# Altium project elektronicy-p-lodz-pl-2018.PrjPCB
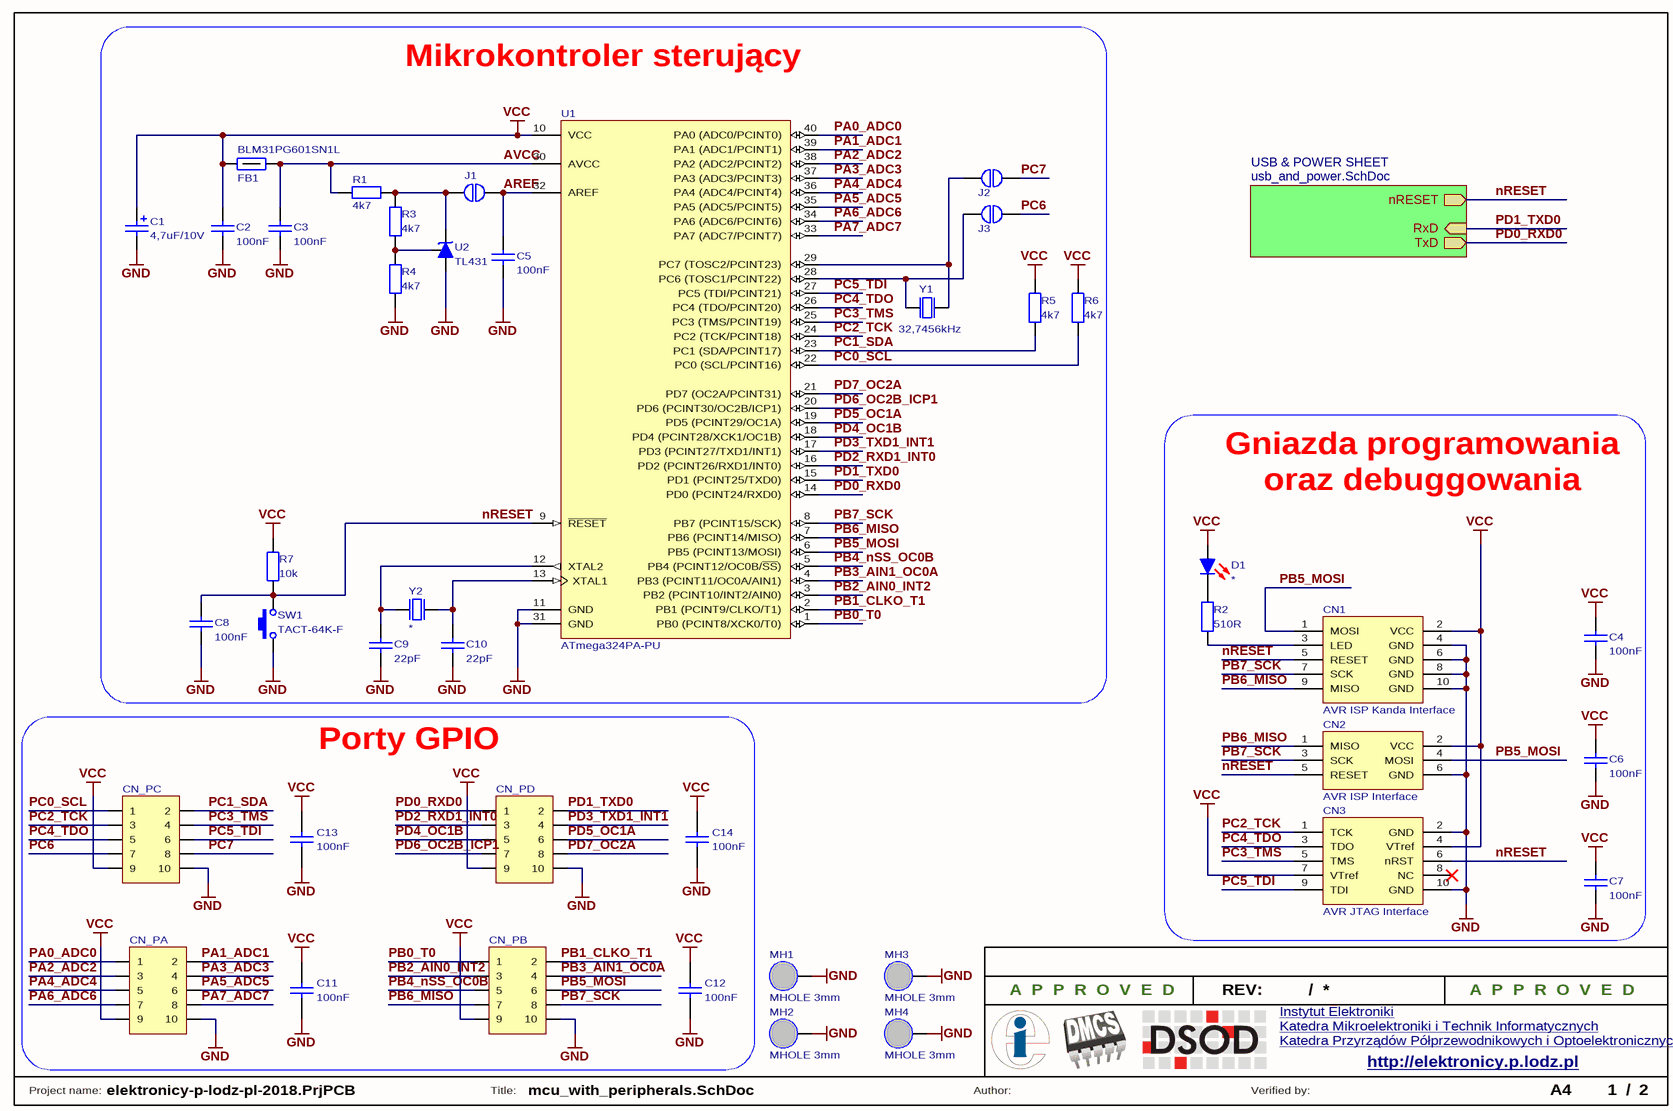
[diagram p0: mcu_with_peripherals.SchDoc]
2 sheets, 72 parts. Net scope: hierarchical (ports join the sheet entries above them; power ports are global).
Board file: pcb.PcbDoc
Sheets:
  mcu_with_peripherals.SchDoc
    USB & POWER SHEET = usb_and_power.SchDoc

## Sheet mcu_with_peripherals.SchDoc
size A4; SheetNumber: 1; SheetTotal: 2; Size: A4; Contact: datasystem.pl

### Parts
C1  4,7uF/10V  [SMDB]
C2  100nF  [C1206]
C3  100nF  [C1206]
C4  100nF  [C1206]
C5  100nF  [C1206]
C6  100nF  [C1206]
C7  100nF  [C1206]
C8  100nF  [C1206]
C9  22pF  [C1206]
C10  22pF  [C1206]
C11  100nF  [C1206]
C12  100nF  [C1206]
C13  100nF  [C1206]
C14  100nF  [C1206]
CN1  AVR ISP Kanda Interface  [IDC10]
CN2  AVR ISP Interface  [IDC6]
CN3  AVR JTAG Interface  [IDC10]
CN_PA  IDC Connector  [IDC10]  (value not drawn)
CN_PB  IDC Connector  [IDC10]  (value not drawn)
CN_PC  IDC Connector  [IDC10]  (value not drawn)
CN_PD  IDC Connector  [IDC10]  (value not drawn)
D1  *  [LED1206R]
FB1  BLM31PG601SN1L  [FB1206]
J1  *  [JMP2_0603_NO]  (value not drawn)
J2  *  [JMP2_0603_NO]  (value not drawn)
J3  *  [JMP2_0603_NO]  (value not drawn)
MH1  MHOLE 3mm  [3mm screw drill III]  (no BOM)
MH2  MHOLE 3mm  [3mm screw drill III]  (no BOM)
MH3  MHOLE 3mm  [3mm screw drill III]  (no BOM)
MH4  MHOLE 3mm  [3mm screw drill III]  (no BOM)
R1  4k7  [R1206]
R2  510R  [R1206]
R3  4k7  [R1206]
R4  4k7  [R1206]
R5  4k7  [R1206]
R6  4k7  [R1206]
R7  10k  [R1206]
SW1  TACT-64K-F  [TACT-64K-F]
U1  ATmega324PA-PU  [DIP40_PRECISION_W_IC]
U2  TL431  [SOT-23]
Y1  32,7456kHz  [TC38_3x8_H]
Y2  *  [HC49-S]

### Blocks framed on the sheet
Mikrokontroler sterujący: C1-C3 C5 C8-C10 FB1 J1-J3 R1 R3-R7 SW1 U1 U2 Y1 Y2
Porty GPIO: C11-C14 CN_PA CN_PB CN_PC CN_PD

### Sub-sheets
USB & POWER SHEET = usb_and_power.SchDoc: RxD (in), TxD (out), nRESET (out)

### Nets
GND: C1.2 C2.1 C3.1 C4.1 C5.1 C6.1 C7.1 C8.1 C9.1 C10.1 C11.1 C12.1 C13.1 C14.1 CN1.4(GND) CN1.6(GND) CN1.8(GND) CN1.10(GND) CN2.6(GND) CN3.2(GND) CN3.10(GND) CN_PA.10 CN_PB.10 CN_PC.10 CN_PD.10 MH1.1(GND) MH2.1(GND) MH3.1(GND) MH4.1(GND) R4.2 SW1.1 U1.11(GND) U1.31(GND) U2.3(A)
VCC: C1.1 C2.2 C4.2 C6.2 C7.2 C11.2 C12.2 C13.2 C14.2 CN1.2(VCC) CN2.2(VCC) CN3.4(VTref) CN3.7(VTref) CN_PA.9 CN_PB.9 CN_PC.9 CN_PD.9 D1.1(A) FB1.1 R5.2 R6.2 R7.2 U1.10(VCC)
AREF: C5.2 J1.2 U1.32(AREF)
AVCC: C3.2 FB1.2 R1.1 U1.30(AVCC)
nRESET: C8.2 CN1.5(RESET) CN2.5(RESET) CN3.6(nRST) R7.1 SW1.2 U1.9(~{RESET}) ; sheet USB & POWER SHEET/nRESET
PA0_ADC0: CN_PA.1 U1.40(PA0_(ADC0/PCINT0))
PA1_ADC1: CN_PA.2 U1.39(PA1_(ADC1/PCINT1))
PA2_ADC2: CN_PA.3 U1.38(PA2_(ADC2/PCINT2))
PA3_ADC3: CN_PA.4 U1.37(PA3_(ADC3/PCINT3))
PA4_ADC4: CN_PA.5 U1.36(PA4_(ADC4/PCINT4))
PA5_ADC5: CN_PA.6 U1.35(PA5_(ADC5/PCINT5))
PA6_ADC6: CN_PA.7 U1.34(PA6_(ADC6/PCINT6))
PA7_ADC7: CN_PA.8 U1.33(PA7_(ADC7/PCINT7))
PB0_T0: CN_PB.1 U1.1(PB0_(PCINT8/XCK0/T0))
PB1_CLKO_T1: CN_PB.2 U1.2(PB1_(PCINT9/CLKO/T1))
PB2_AIN0_INT2: CN_PB.3 U1.3(PB2_(PCINT10/INT2/AIN0))
PB3_AIN1_OC0A: CN_PB.4 U1.4(PB3_(PCINT11/OC0A/AIN1))
PB4_nSS_OC0B: CN_PB.5 U1.5(PB4_(PCINT12/OC0B/~{SS}))
PB5_MOSI: CN1.1(MOSI) CN2.4(MOSI) CN_PB.6 U1.6(PB5_(PCINT13/MOSI))
PB6_MISO: CN1.9(MISO) CN2.1(MISO) CN_PB.7 U1.7(PB6_(PCINT14/MISO))
PB7_SCK: CN1.7(SCK) CN2.3(SCK) CN_PB.8 U1.8(PB7_(PCINT15/SCK))
PC0_SCL: CN_PC.1 R6.1 U1.22(PC0_(SCL/PCINT16))
PC1_SDA: CN_PC.2 R5.1 U1.23(PC1_(SDA/PCINT17))
PC2_TCK: CN3.1(TCK) CN_PC.3 U1.24(PC2_(TCK/PCINT18))
PC3_TMS: CN3.5(TMS) CN_PC.4 U1.25(PC3_(TMS/PCINT19))
PC4_TDO: CN3.3(TDO) CN_PC.5 U1.26(PC4_(TDO/PCINT20))
PC5_TDI: CN3.9(TDI) CN_PC.6 U1.27(PC5_(TDI/PCINT21))
PC6: CN_PC.7 J3.2
PC7: CN_PC.8 J2.2
PD0_RXD0: CN_PD.1 U1.14(PD0_(PCINT24/RXD0)) ; sheet USB & POWER SHEET/TxD
PD1_TXD0: CN_PD.2 U1.15(PD1_(PCINT25/TXD0)) ; sheet USB & POWER SHEET/RxD
PD2_RXD1_INT0: CN_PD.3 U1.16(PD2_(PCINT26/RXD1/INT0))
PD3_TXD1_INT1: CN_PD.4 U1.17(PD3_(PCINT27/TXD1/INT1))
PD4_OC1B: CN_PD.5 U1.18(PD4_(PCINT28/XCK1/OC1B))
PD5_OC1A: CN_PD.6 U1.19(PD5_(PCINT29/OC1A))
PD6_OC2B_ICP1: CN_PD.7 U1.20(PD6_(PCINT30/OC2B/ICP1))
PD7_OC2A: CN_PD.8 U1.21(PD7_(OC2A/PCINT31))
NetC9_2: C9.2 U1.12(XTAL2) Y2.1(OSC1)
NetC10_2: C10.2 U1.13(XTAL1) Y2.2(OSC2)
NetCN1_3: CN1.3(LED) R2.1
NetD1_2: D1.2(K) R2.2
NetJ1_1: J1.1 R1.2 R3.1 U2.1(K)
NetJ2_1: J2.1 U1.29(PC7_(TOSC2/PCINT23)) Y1.1(OSC1)
NetJ3_1: J3.1 U1.28(PC6_(TOSC1/PCINT22)) Y1.2(OSC2)
NetR3_2: R3.2 R4.1 U2.2(REF)

Not connected (* = marked no-connect by the designer): CN3 8(NC)*

### Notes on the sheet
- Gniazda programowania
- oraz debuggowania
- A  P  P  R  O  V  E  D
- REV:
- /
- Instytut Elektroniki <http://www.eletel.p.lodz.pl/>
- Katedra Mikroelektroniki i Technik Informatycznych <https://www.dmcs.pl/>
- Katedra Przyrządów Półprzewodnikowych i Optoelektronicznych <http://www.dsod.p.lodz.pl/>
- http://elektronicy.p.lodz.pl
- Project name:
- Title:
- Author:
- Verified by:

### Library data of the parts
C1 = Cap Pol Tant: Polarized Tantalum Capacitor; ComponentLink1Description: datasheet; ComponentLink2Description: supplier; Value: 4,7uF/10V
C2-C14 = Cap: Capacitor; ComponentLink1Description: datasheet; ComponentLink2Description: supplier
  C2-C8 C11-C14: Value: 100nF
  C9 C10: Value: 22pF
CN1 = AVR ISP Kanda Interface: Kanda ISP Programming Header for AVR MCU's
CN2 = AVR ISP Interface: ISP Programming Header for AVR MCU's
CN3 = AVR JTAG Interface: JTAG Header for AVR MCU's
CN_PA CN_PB CN_PC CN_PD = CN_5x2
D1 = LED_RED: RED LED; Published: 04-Apr-2006
FB1 = BLM31PG601SN1L: Ferrite Bead; Imp.@ 100MHz:600R; Mounting: SMD; 1,5A; Case: 1206
J1-J3 = JUMPER2_NO: Solder Jumper - Open
MH1-MH4 = MHOLE_3MM: 3mm Mounting Hole
R1 R3-R7 = Res: Resistor; Published: 19-Feb-2006; ComponentLink1Description: datasheet; ComponentLink2Description: supplier
  R1 R3-R6: Value: 4k7
  R7: Value: 10k
R2 = Res: Resistor; Value: 4k7; Published: 19-Feb-2006; ComponentLink1Description: datasheet; ComponentLink2Description: supplier
SW1 = TACT-64K-F: 6x6mm THT Tactile SPST-NO Switch; Published: 30-Jun-2006
U1 = ATmega324PA-PU: 8-bit AVR Microcontroller, 32KB Flash, 1KB EEPROM, 2KB SRAM, 40-pin PDIP, Industrial Grade (-40°C to 85°C); DatasheetVersion: revC, Jun-2011; PackageVersion: revB, Sep-2001; PackageReference: 40P6; PackageDescription: 40-lead (0.600"/15.24mm Wide) Plastic Dual Inline Package (PDIP); Code_JEDEC: MS-011-AC; ComponentLink1Description: Manufacturer URL; ComponentLink1URL: http://www.atmel.com/; ComponentLink2Description: ATmega164A/164PA/324A/324PA/644A/644PA/1284/1284P Datasheet; ComponentLink2URL: http://www.atmel.com/dyn/resources/prod_documents/doc8272.pdf; ComponentLink3Description: ATmega164A/164PA/324A/324PA/644A/644PA/1284/1284P Summary; ComponentLink3URL: http://www.atmel.com/dyn/resources/prod_documents/8272S.pdf
U2 = TL431BCDBZ: 0,5% Precision Programmable Reference
Y1 = Clock XTAL: Crystal Clock Oscillator; ComponentLink1Description: datasheet; ComponentLink2Description: supplier; Value: 32,7456kHz
Y2 = XTAL_2PIN: Crystal Oscillator; ComponentLink1Description: datasheet; ComponentLink2Description: supplier; Value: *

## Sheet usb_and_power.SchDoc
size A4; SheetNumber: 2; SheetTotal: 2; Size: A4; Contact: datasystem.pl
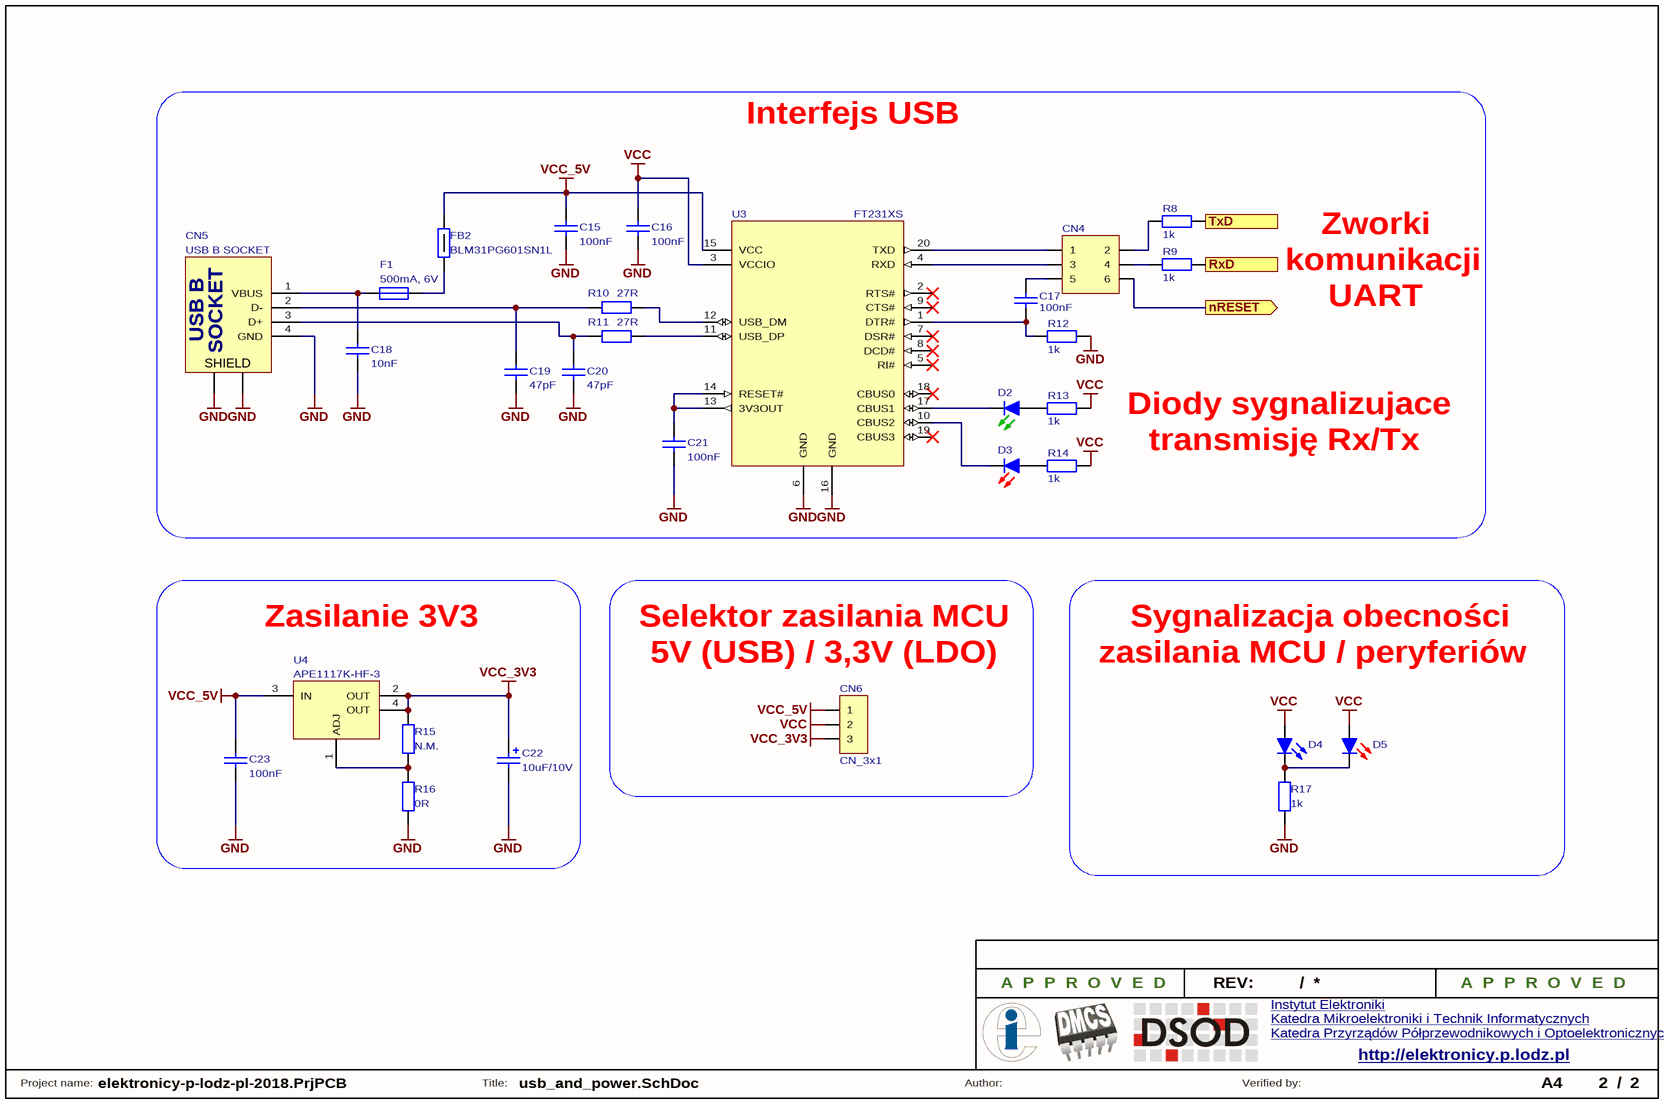
[diagram p1: usb_and_power.SchDoc]

### Parts
C15  100nF  [C1206]
C16  100nF  [C1206]
C17  100nF  [C1206]
C18  10nF  [C1206]
C19  47pF  [C1206]
C20  47pF  [C1206]
C21  100nF  [C1206]
C22  10uF/10V  [SMDB]
C23  100nF  [C1206]
CN4  *  [GP_3x2]  (value not drawn)
CN5  USB B SOCKET  [USBB-G]
CN6  CN_3x1  [GP_3x1H]
D2  *  [LED1206G]  (value not drawn)
D3  *  [LED1206R]  (value not drawn)
D4  LED  [LED-Polarized - 3mm]  (value not drawn)
D5  *  [LED1206R]  (value not drawn)
F1  500mA, 6V  [F1206]
FB2  BLM31PG601SN1L  [FB1206]
R8  1k  [R1206]
R9  1k  [R1206]
R10  27R  [R1206]
R11  27R  [R1206]
R12  1k  [R1206]
R13  1k  [R1206]
R14  1k  [R1206]
R15  N.M.  [R1206]
R16  0R  [R1206]
R17  1k  [R1206]
U3  FT231XS  [SSOP20]
U4  APE1117K-HF-3  [SOT-223]

### Blocks framed on the sheet
Zasilanie 3V3: C22 C23 R15 R16 U4

### Ports
nRESET (out), RxD (in), TxD (out)

### Nets
GND: C15.2 C16.2 C18.2 C19.1 C20.1 C21.1 C22.2 C23.1 CN5.4(GND) CN5.5(SHIELD) CN5.6(SHIELD) R12.1 R16.1 R17.1 U3.6(GND) U3.16(GND)
VCC: C16.1 CN6.2 D4.1(A) D5.1(A) R13.1 R14.1 U3.3(VCCIO)
VCC_3V3: C22.1 CN6.3 R15.2 U4.2(OUT) U4.4(OUT)
VCC_5V: C15.1 C23.2 CN6.1 FB2.1 U3.15(VCC) U4.3(IN)
nRESET: CN4.6 ; port nRESET
PD0_RXD0: R8.1 ; port TxD
PD1_TXD0: R9.1 ; port RxD
NetC17_1: C17.1 R12.2 U3.1(DTR#)
NetC17_2: C17.2 CN4.5
NetC18_1: C18.1 CN5.1(VBUS) F1.1
NetC19_2: C19.2 CN5.2(D-) R10.1
NetC20_2: C20.2 CN5.3(D+) R11.1
NetC21_2: C21.2 U3.13(3V3OUT) U3.14(RESET#)
NetCN4_1: CN4.1 U3.20(TXD)
NetCN4_2: CN4.2 R8.2
NetCN4_3: CN4.3 U3.4(RXD)
NetCN4_4: CN4.4 R9.2
NetD2_1: D2.1(A) R13.2
NetD2_2: D2.2(K) U3.17(CBUS1)
NetD3_1: D3.1(A) R14.2
NetD3_2: D3.2(K) U3.10(CBUS2)
NetD4_2: D4.2(K) D5.2(K) R17.2
NetF1_2: F1.2 FB2.2
NetR10_2: R10.2 U3.12(USB_DM)
NetR11_2: R11.2 U3.11(USB_DP)
NetR15_1: R15.1 R16.2 U4.1(ADJ)

Not connected (* = marked no-connect by the designer): U3 2(RTS#)* 5(RI#)* 7(DSR#)* 8(DCD#)* 9(CTS#)* 18(CBUS0)* 19(CBUS3)*

### Notes on the sheet
- Interfejs USB
- Zworki
- komunikacji
- UART
- Diody sygnalizujace
- transmisję Rx/Tx
- Selektor zasilania MCU
- Sygnalizacja obecności
- (near CN6) 5V (USB) / 3,3V (LDO)
- zasilania MCU / peryferiów
- A  P  P  R  O  V  E  D
- REV:
- /
- Instytut Elektroniki <http://www.eletel.p.lodz.pl/>
- Katedra Mikroelektroniki i Technik Informatycznych <https://www.dmcs.pl/>
- Katedra Przyrządów Półprzewodnikowych i Optoelektronicznych <http://www.dsod.p.lodz.pl/>
- http://elektronicy.p.lodz.pl
- Project name:
- Title:
- Author:
- Verified by:
- (in symbol USB B SOCKET) USB B; SOCKET

### Library data of the parts
C15-C21 C23 = Cap: Capacitor; ComponentLink1Description: datasheet; ComponentLink2Description: supplier
  C15-C17 C21 C23: Value: 100nF
  C18: Value: 10nF
  C19 C20: Value: 47pF
C22 = Cap Pol Tant: Polarized Tantalum Capacitor; ComponentLink1Description: datasheet; ComponentLink2Description: supplier; Value: 10uF/10V
CN4 = CN_3x2
CN5 = USB B SOCKET: USB connector; Published: 20-Mar-2006
D2 = LED_GREEN: GREEN LED; Published: 04-Apr-2006
D3 D5 = LED_RED: RED LED; Published: 04-Apr-2006
D4 = LED: Typical RED, GREEN, YELLOW, AMBER GaAs LED; Published: 04-Apr-2006
F1 = 1206L050: 500mA, 6V PTC Fuse; Published: 8-Jun-2000; LatestRevisionDate: 17-Jul-2002; LatestRevisionNote: Re-released for DXP Platform.; PackageReference: PIN-W2/E2.8; Publisher: Altium Limited; PackageDescription: Thru-Hole; 2 Leads; Supplier 1: TME; Supplier Part Number 1: SM010-60
FB2 = BLM31PG601SN1L: as FB1 on sheet mcu_with_peripherals
R8-R17 = Res: Resistor; Published: 19-Feb-2006; ComponentLink1Description: datasheet; ComponentLink2Description: supplier
  R8 R9 R12-R14 R17: Value: 1k
  R10 R11: Value: 27R
  R15: Value: N.M.
  R16: Value: 0R
U3 = FT231XS: FT231X USB to UART IC; Published: 07-Mar-2006; PackageReference: SSOP28; ComponentLink1Description: Manufacturer Link; ComponentLink1URL: http://www.ftdichip.com/Products/ICs/FT232R.htm; ComponentLink2Description: Datasheet; ComponentLink2URL: http://www.ftdichip.com/Support/Documents/DataSheets/ICs/DS_FT232R.pdf; Supplier 1: TME; Supplier 2: TME; Supplier 3: Farnell; Supplier 4: Farnell; Supplier Part Number 1: FT231XS-U; Supplier Part Number 2: FT231XS-R; Supplier Part Number 3: 2081328RL; Supplier Part Number 4: 2081328
U4 = APE1117K-HF-3: 800mA Low-Dropout Adjustable, 1A Linear Regulator, SOT223 Package; Published: 24-Aug-2001; LatestRevisionDate: 06-Jun-2005; LatestRevisionNote: PCB Pin sequence re-ordered.; DatasheetVersion: Feb-2004; PackageVersion: Jul-2004; PackageReference: TO-220A; Publisher: Altium Limited; PackageDescription: TO, Thru-Hole, Vertical, Heatsink Mounted; 3 In-Line Leads; Pitch 2.54 mm; ComponentLink1Description: Manufacturer Link; ComponentLink1URL: http://www.st.com/; ComponentLink2Description: Datasheet; ComponentLink2URL: http://www.st.com/stonline/books/pdf/docs/2574.pdf; Supplier 1: TME; Supplier Part Number 1: APE1117K-HF-3

## Nets that join several sheets
GND: mcu_with_peripherals (34 pins), usb_and_power (16 pins)
VCC: mcu_with_peripherals (23 pins), usb_and_power (7 pins)
nRESET: mcu_with_peripherals (7 pins), usb_and_power (CN4.6)
PD0_RXD0: mcu_with_peripherals (CN_PD.1 U1.14), usb_and_power (R8.1)
PD1_TXD0: mcu_with_peripherals (CN_PD.2 U1.15), usb_and_power (R9.1)